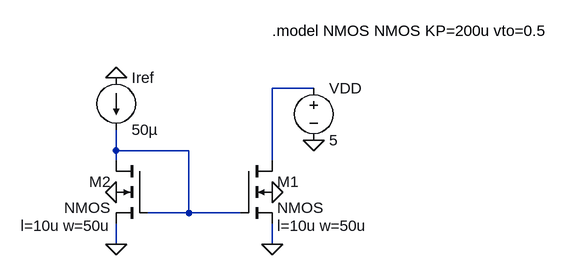
[diagram p0: schematic currentMirror.asc]
currentMirror.asc, the LTspice schematic file:
Version 4
SHEET 1 880 680
WIRE 336 32 272 32
WIRE 32 128 32 96
WIRE 144 128 32 128
WIRE 32 144 32 128
WIRE 272 144 272 32
WIRE 144 224 144 128
WIRE 144 224 80 224
WIRE 224 224 144 224
WIRE 32 272 32 240
WIRE 272 272 272 240
FLAG 32 272 0
FLAG 272 272 0
FLAG 336 112 0
FLAG 32 16 0
FLAG 32 192 0
FLAG 272 192 0
SYMBOL voltage 336 16 R0
WINDOW 123 0 0 Left 0
WINDOW 39 0 0 Left 0
SYMATTR InstName VDD
SYMATTR Value 5
SYMBOL nmos4 224 144 R0
WINDOW 123 56 100 Left 2
SYMATTR InstName M1
SYMATTR Value2 l=10u w=50u
SYMBOL nmos4 80 144 M0
WINDOW 123 56 100 Left 2
SYMATTR InstName M2
SYMATTR Value2 l=10u w=50u
SYMBOL current 32 16 R0
WINDOW 123 0 0 Left 0
WINDOW 39 0 0 Left 0
SYMATTR InstName Iref
SYMATTR Value 50µ
TEXT 272 -56 Left 2 !.model NMOS NMOS KP=200u vto=0.5

The netlist it stands for:
* currentMirror.asc
VDD N001 0 5
M1 N001 N002 0 0 NMOS l=10u w=50u
M2 N002 N002 0 0 NMOS l=10u w=50u
Iref 0 N002 50µ
.model NMOS NMOS
.model PMOS PMOS
.lib standard.mos
.model NMOS NMOS KP=200u vto=0.5
.backanno
.end